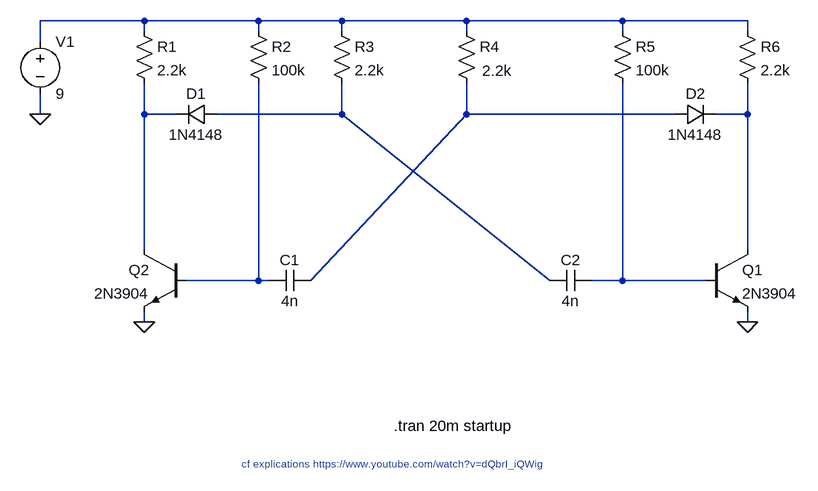
[diagram p0: schematic astable4.asc]
astable4.asc, the LTspice schematic file:
Version 4
SHEET 1 880 692
WIRE -208 0 -368 0
WIRE -32 0 -208 0
WIRE 96 0 -32 0
WIRE 288 0 96 0
WIRE 528 0 288 0
WIRE 720 0 528 0
WIRE -208 16 -208 0
WIRE -32 16 -32 0
WIRE 96 16 96 0
WIRE 288 16 288 0
WIRE 528 16 528 0
WIRE 720 16 720 0
WIRE -368 32 -368 0
WIRE -368 144 -368 112
WIRE -208 144 -208 96
WIRE -160 144 -208 144
WIRE 96 144 96 96
WIRE 96 144 -96 144
WIRE 288 144 288 96
WIRE 608 144 288 144
WIRE 720 144 720 96
WIRE 720 144 672 144
WIRE -208 352 -208 144
WIRE 720 352 720 144
WIRE -32 400 -32 96
WIRE -32 400 -144 400
WIRE -16 400 -32 400
WIRE 48 400 288 144
WIRE 416 400 96 144
WIRE 528 400 528 96
WIRE 528 400 480 400
WIRE 656 400 528 400
WIRE -208 464 -208 448
WIRE 720 464 720 448
FLAG 720 464 0
FLAG -208 464 0
FLAG -368 144 0
SYMBOL RES -224 0 R0
SYMATTR InstName R1
SYMATTR Value 2.2k
SYMBOL res 704 0 R0
SYMATTR InstName R6
SYMATTR Value 2.2k
SYMBOL res 80 0 R0
SYMATTR InstName R3
SYMATTR Value 2.2k
SYMBOL res 272 0 R0
WINDOW 3 40 77 Left 2
SYMATTR Value 2.2k
SYMATTR InstName R4
SYMBOL cap 48 384 R90
WINDOW 0 0 32 VBottom 2
WINDOW 3 32 32 VTop 2
SYMATTR InstName C1
SYMATTR Value 4n
SYMBOL cap 480 384 R90
WINDOW 0 0 32 VBottom 2
WINDOW 3 32 32 VTop 2
SYMATTR InstName C2
SYMATTR Value 4n
SYMBOL VOLTAGE -368 16 R0
WINDOW 123 0 0 Left 0
WINDOW 39 0 0 Left 0
SYMATTR InstName V1
SYMATTR Value 9
SYMBOL NPN 656 352 R0
SYMATTR InstName Q1
SYMATTR Value 2N3904
SYMBOL npn -144 352 M0
SYMATTR InstName Q2
SYMATTR Value 2N3904
SYMBOL diode -96 128 R90
WINDOW 0 0 32 VBottom 2
WINDOW 3 32 32 VTop 2
SYMATTR InstName D1
SYMATTR Value 1N4148
SYMBOL diode 608 160 R270
WINDOW 0 32 32 VTop 2
WINDOW 3 0 32 VBottom 2
SYMATTR InstName D2
SYMATTR Value 1N4148
SYMBOL res -48 0 R0
SYMATTR InstName R2
SYMATTR Value 100k
SYMBOL res 512 0 R0
SYMATTR InstName R5
SYMATTR Value 100k
TEXT 176 624 Left 2 !.tran 20m startup
TEXT 168 672 Top 1 ;cf explications https://www.youtube.com/watch?v=dQbrI_iQWig

The netlist it stands for:
* astable4.asc
R1 N001 N002 2.2k
R6 N001 N005 2.2k
R3 N001 N003 2.2k
R4 N001 N004 2.2k
C1 N004 N006 4n
C2 N007 N003 4n
V1 N001 0 9
Q1 N005 N007 0 0 2N3904
Q2 N002 N006 0 0 2N3904
D1 N003 N002 1N4148
D2 N004 N005 1N4148
R2 N001 N006 100k
R5 N001 N007 100k
.model D D
.lib standard.dio
.model NPN NPN
.model PNP PNP
.lib standard.bjt
.tran 20m startup
* cf explications https://www.youtube.com/watch?v=dQbrI_iQWig
.backanno
.end